# Altium schematic sheet ankle_sch.SchDoc
size A; SheetNumber: 2; SheetTotal: 2
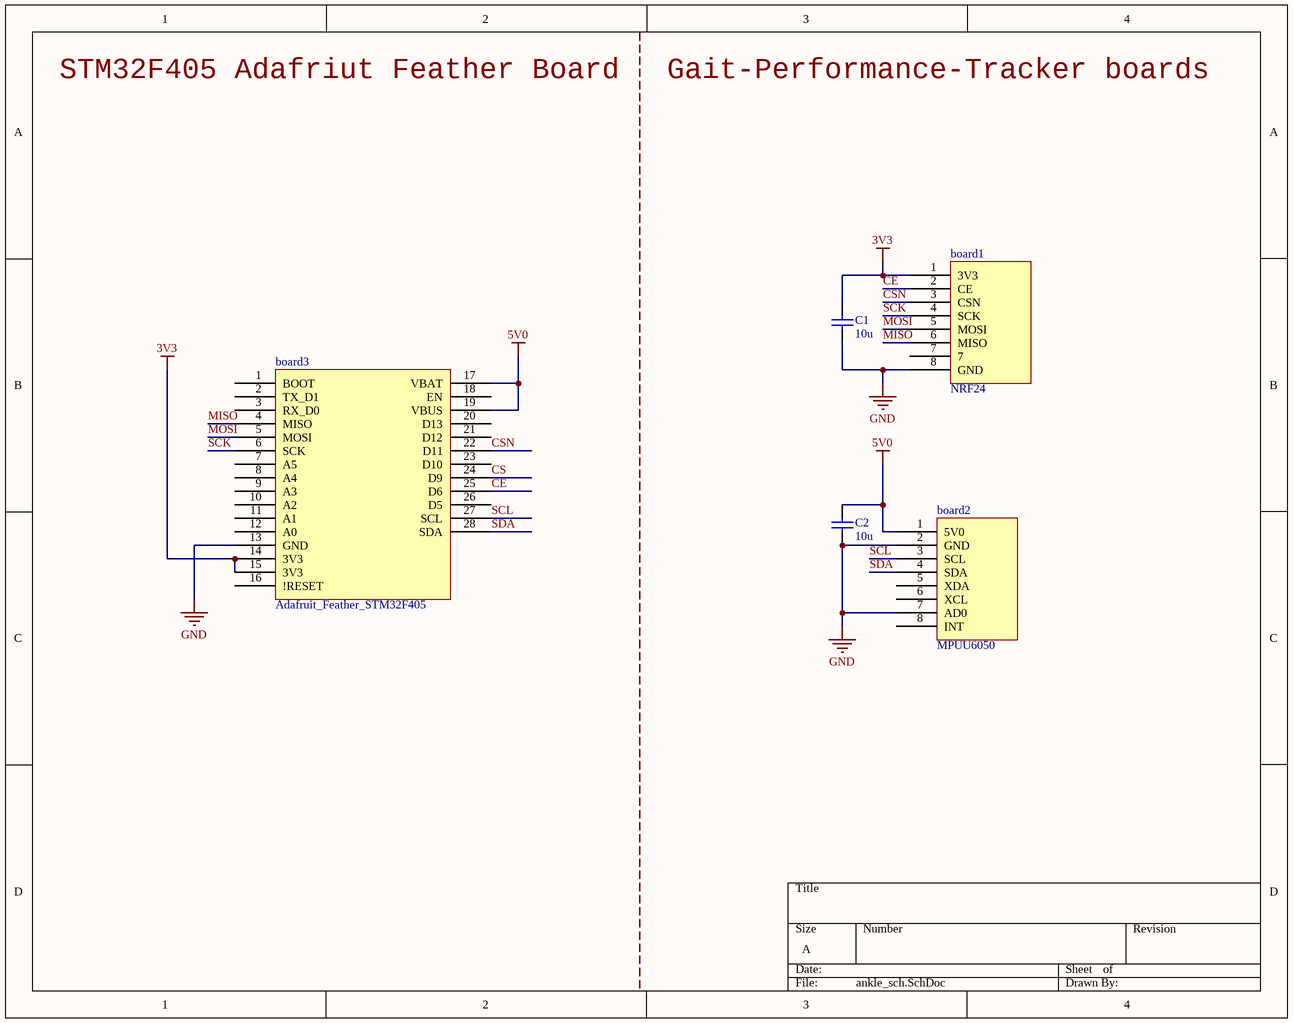
[diagram p0: ankle_sch.SchDoc]

## Parts
board1  NRF24  [nrf24]
board2  MPUU6050  [mpu6050]
board3  Adafruit_Feather_STM32F405  [Adafruit_Feather_STM32F405]
C1  value 10u  (hidden comment: Capacitor)
C2  value 10u  (hidden comment: Capacitor)

## Nets
3V3: board1.1(3V3) board3.14(3V3) board3.15(3V3) C1.2
5V0: board2.1(5V0) board3.17(VBAT) board3.19(VBUS) C2.2
GND: board1.8(GND) board2.2(GND) board2.7(AD0) board3.13(GND) C1.1 C2.1
CE: board1.2(CE) board3.25(D6)
CS: board3.24(D9)
CSN: board1.3(CSN) board3.22(D11)
MISO: board1.6(MISO) board3.4(MISO)
MOSI: board1.5(MOSI) board3.5(MOSI)
SCK: board1.4(SCK) board3.6(SCK)
SCL: board2.3(SCL) board3.27(SCL)
SDA: board2.4(SDA) board3.28(SDA)

Not connected (* = marked no-connect by the designer): board1 7; board2 5(XDA) 6(XCL) 8(INT); board3 1(BOOT) 2(TX_D1) 3(RX_D0) 7(A5) 8(A4) 9(A3) 10(A2) 11(A1) 12(A0) 16(!RESET) 18(EN) 20(D13) 21(D12) 23(D10) 26(D5)

## Notes on the sheet
- STM32F405 Adafriut Feather Board
- Gait-Performance-Tracker boards

## Library data of the parts
C1 C2 = Capacitor: SimulationGenericComponent: True